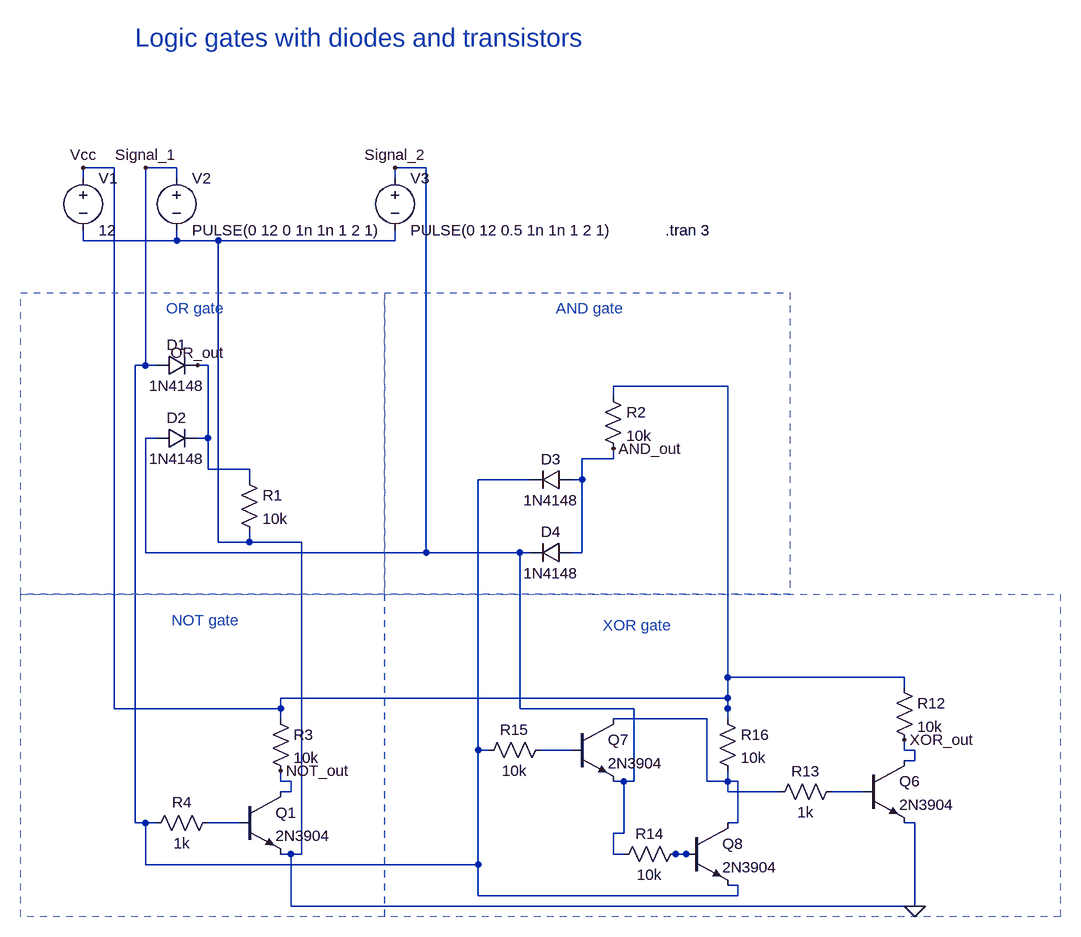
[diagram p0: schematic Logic-gates-diodes-transistors.asc]
Logic-gates-diodes-transistors.asc, the LTspice schematic file:
Version 4.1
SHEET 1 1880 1556
WIRE 64 944 80 944
WIRE 1024 896 1040 896
WIRE 16 448 16 464
WIRE -240 -16 -240 0
WIRE -96 -16 -96 0
WIRE 240 -16 240 0
WIRE 80 944 96 944
WIRE 96 944 96 464
WIRE 96 464 16 464
WIRE 16 464 -32 464
WIRE -32 464 -32 0
WIRE -32 0 -96 0
WIRE -96 0 -240 0
WIRE -96 0 240 0
WIRE 80 944 80 1024
WIRE 80 1024 1040 1024
WIRE 1040 1024 1040 896
FLAG 1040 1024 0
WIRE 512 368 528 368
WIRE 512 480 528 480
WIRE 576 320 576 336
WIRE 528 368 528 336
WIRE 528 336 576 336
WIRE 528 368 528 480
FLAG 576 320 AND_out
WIRE 576 736 592 736
WIRE 752 896 768 896
WIRE 832 848 816 848
WIRE 752 816 752 832
WIRE 592 736 720 736
WIRE 720 736 720 832
WIRE 720 832 752 832
WIRE 752 832 768 832
WIRE 768 832 768 896
WIRE 752 832 752 848
WIRE 752 848 816 848
WIRE 512 784 496 784
WIRE 464 784 480 784
WIRE 496 784 480 784
WIRE 960 848 944 848
WIRE 912 848 928 848
WIRE 944 848 928 848
WIRE 0 896 -16 896
WIRE -48 896 -32 896
WIRE -16 896 -32 896
WIRE 688 944 672 944
WIRE 672 944 688 944
WIRE 64 848 80 848
WIRE 64 816 64 832
WIRE 80 848 80 832
WIRE 80 832 64 832
FLAG 64 816 NOT_out
WIRE -64 192 -48 192
WIRE -64 304 -48 304
WIRE 16 368 16 352
WIRE -48 192 -48 304
WIRE -48 304 -48 352
WIRE -48 352 16 352
FLAG -64 192 OR_out
WIRE -128 192 -144 192
WIRE 448 368 432 368
WIRE 752 992 768 992
WIRE 384 784 368 784
WIRE -128 896 -144 896
WIRE -96 -96 -96 -112
WIRE -144 192 -144 -112
WIRE -144 -112 -96 -112
WIRE -144 192 -160 192
WIRE -160 192 -160 896
WIRE -160 896 -144 896
WIRE -144 896 -144 960
WIRE -144 960 368 960
WIRE 368 960 368 784
WIRE 368 784 368 368
WIRE 368 368 432 368
WIRE 368 784 368 1008
WIRE 368 1008 768 1008
WIRE 768 1008 768 992
FLAG -144 -112 Signal_1
WIRE -128 304 -144 304
WIRE 448 480 432 480
WIRE 576 832 592 832
WIRE 592 944 576 944
WIRE 240 -96 240 -112
WIRE -144 304 -144 480
WIRE -144 480 432 480
WIRE 432 480 432 720
WIRE 432 720 608 720
WIRE 608 720 608 832
WIRE 608 832 592 832
WIRE 592 832 592 912
WIRE 592 912 576 912
WIRE 576 912 576 944
WIRE 432 480 288 480
WIRE 288 480 288 -112
WIRE 288 -112 240 -112
FLAG 240 -112 Signal_2
WIRE 1024 688 1024 672
WIRE 752 736 752 720
WIRE 576 240 576 224
WIRE 64 736 64 720
WIRE -240 -96 -240 -112
WIRE 1024 672 752 672
WIRE 752 672 752 720
WIRE 752 720 752 224
WIRE 752 224 576 224
WIRE 752 720 752 704
WIRE 752 704 64 704
WIRE 64 704 64 720
WIRE 64 720 -192 720
WIRE -192 720 -192 -112
WIRE -192 -112 -240 -112
FLAG -240 -112 Vcc
WIRE 1024 800 1040 800
WIRE 1024 768 1024 784
WIRE 1040 800 1040 784
WIRE 1040 784 1024 784
FLAG 1024 768 XOR_out
SYMBOL diode -128 208 R270
WINDOW 0 32 32 VTop 2
WINDOW 3 0 32 VBottom 2
SYMATTR InstName D1
SYMATTR Value 1N4148
SYMBOL diode -128 320 R270
WINDOW 0 32 32 VTop 2
WINDOW 3 0 32 VBottom 2
SYMATTR InstName D2
SYMATTR Value 1N4148
SYMBOL res 0 352 R0
SYMATTR InstName R1
SYMATTR Value 10k
SYMBOL diode 512 352 R90
WINDOW 0 0 32 VBottom 2
WINDOW 3 32 32 VTop 2
SYMATTR InstName D3
SYMATTR Value 1N4148
SYMBOL diode 512 464 R90
WINDOW 0 0 32 VBottom 2
WINDOW 3 32 32 VTop 2
SYMATTR InstName D4
SYMATTR Value 1N4148
SYMBOL res 560 224 R0
SYMATTR InstName R2
SYMATTR Value 10k
SYMBOL voltage -240 -112 R0
WINDOW 123 0 0 Left 0
WINDOW 39 0 0 Left 0
SYMATTR InstName V1
SYMATTR Value 12
SYMBOL voltage -96 -112 R0
WINDOW 123 0 0 Left 0
WINDOW 39 0 0 Left 0
SYMATTR InstName V2
SYMATTR Value PULSE(0 12 0 1n 1n 1 2 1)
SYMBOL voltage 240 -112 R0
WINDOW 123 0 0 Left 0
WINDOW 39 0 0 Left 0
SYMATTR InstName V3
SYMATTR Value PULSE(0 12 0.5 1n 1n 1 2 1)
SYMBOL res 48 720 R0
SYMATTR InstName R3
SYMATTR Value 10k
SYMBOL npn 0 848 R0
SYMATTR InstName Q1
SYMATTR Value 2N3904
SYMBOL res -32 880 R90
WINDOW 0 0 56 VBottom 2
WINDOW 3 32 56 VTop 2
SYMATTR InstName R4
SYMATTR Value 1k
SYMBOL res 1008 672 R0
SYMATTR InstName R12
SYMATTR Value 10k
SYMBOL npn 960 800 R0
SYMATTR InstName Q6
SYMATTR Value 2N3904
SYMBOL res 928 832 R90
WINDOW 0 0 56 VBottom 2
WINDOW 3 32 56 VTop 2
SYMATTR InstName R13
SYMATTR Value 1k
SYMBOL npn 512 736 R0
SYMATTR InstName Q7
SYMATTR Value 2N3904
SYMBOL npn 688 896 R0
SYMATTR InstName Q8
SYMATTR Value 2N3904
SYMBOL res 688 928 R90
WINDOW 0 0 56 VBottom 2
WINDOW 3 32 56 VTop 2
SYMATTR InstName R14
SYMATTR Value 10k
SYMBOL res 480 768 R90
WINDOW 0 0 56 VBottom 2
WINDOW 3 32 56 VTop 2
SYMATTR InstName R15
SYMATTR Value 10k
SYMBOL res 736 720 R0
SYMATTR InstName R16
SYMATTR Value 10k
TEXT 656 -16 Left 2 !.tran 3
TEXT 488 104 Left 2 ;AND gate
TEXT -112 104 Left 2 ;OR gate
TEXT -160 -312 Left 4 ;Logic gates with diodes and transistors
TEXT -104 584 Left 2 ;NOT gate
TEXT 560 592 Left 2 ;XOR gate
RECTANGLE Normal 224 544 -336 80 2
RECTANGLE Normal 848 544 224 80 2
RECTANGLE Normal 224 1040 -336 544 2
RECTANGLE Normal 1264 1040 224 544 2

The netlist it stands for:
* Logic-gates-diodes-transistors.asc
D1 Signal_1 OR_out 1N4148
D2 Signal_2 OR_out 1N4148
R1 OR_out 0 10k
D3 AND_out Signal_1 1N4148
D4 AND_out Signal_2 1N4148
R2 Vcc AND_out 10k
V1 Vcc 0 12
V2 Signal_1 0 PULSE(0 12 0 1n 1n 1 2 1)
V3 Signal_2 0 PULSE(0 12 0.5 1n 1n 1 2 1)
R3 Vcc NOT_out 10k
Q1 NOT_out N004 0 0 2N3904
R4 N004 Signal_1 1k
R12 Vcc XOR_out 10k
Q6 XOR_out N003 0 0 2N3904
R13 N003 N001 1k
Q7 N001 N002 Signal_2 0 2N3904
Q8 N001 N005 Signal_1 0 2N3904
R14 N005 Signal_2 10k
R15 N002 Signal_1 10k
R16 Vcc N001 10k
.model D D
.lib standard.dio
.model NPN NPN
.model PNP PNP
.lib standard.bjt
.tran 3
* AND gate
* OR gate
* Logic gates with diodes and transistors
* NOT gate
* XOR gate
.backanno
.end